# EasyEDA schematic RP2040.json
TITLE: RP2040 Minimal Design for JLCPCB; REV: 1.0; Date: 2023-03-28; Sheet: 1/1; Drawn By: Jeff Rebeiro; Company: ACustomArcade
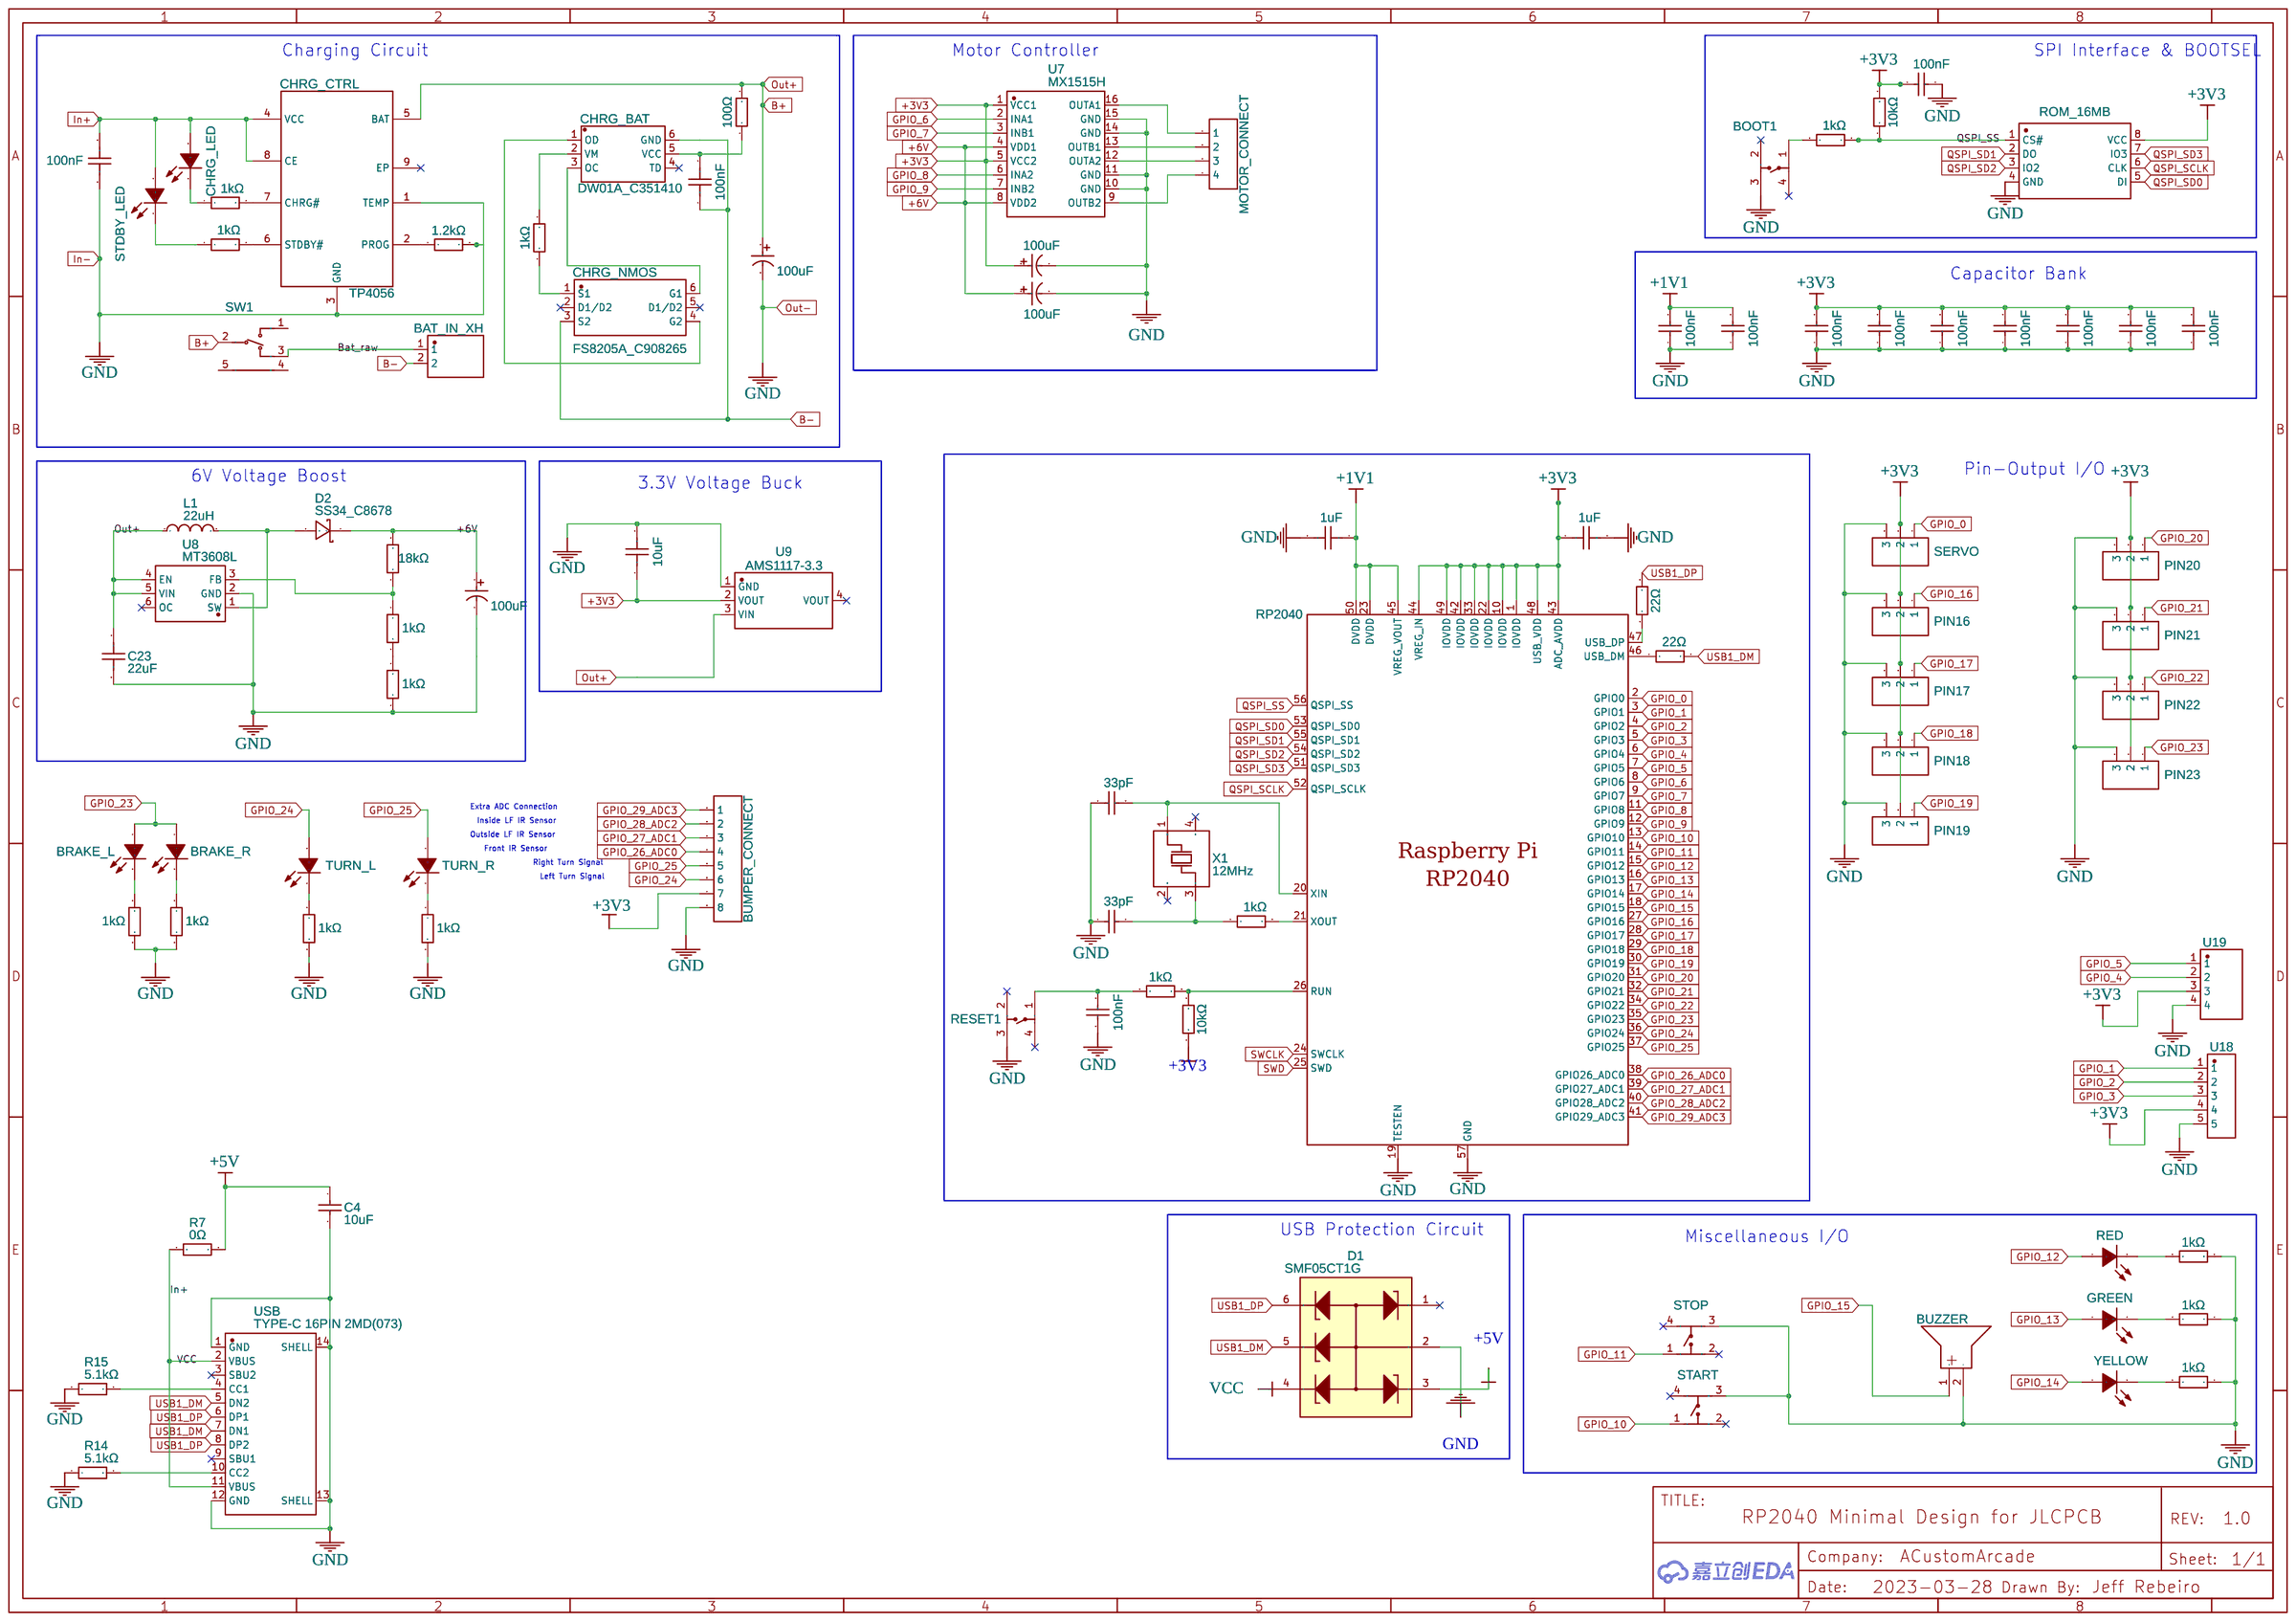
[diagram p0: schematic sheet]

## Parts
BAT_IN_XH  B2B-XH-A (LF)(SN)  [CONN-TH_B2B-XH-A-LF-SN]
BOOT1  TD-1182SA-2.0H-250  [SW-SMD_4P-L3.5-W3.0-P1.50-LS4.6_DEALON_TD-1182SA-2.0H-250]
BRAKE_L  E6C0805UR  [LED0805-R-RD]
BRAKE_R  E6C0805UR  [LED0805-R-RD]
BUMPER_CONNECT  HDR-F-2.54_1x8  [HDR-F-2.54_1X8]
BUZZER  3kHz  [BUZ-TH_BD9.0-P5.00-D0.6-FD]
C1  100uF  [CAP-SMD_BD6.3-L6.6-W6.6-LS7.2-R-RD]
C2  33pF  [C0402]
C3  33pF  [C0402]
C4  10uF  [C1206]
C5  100nF  [C0402_NEW]
C6  100nF  [C0402_NEW]
C7  100nF  [C0402_NEW]
C8  1uF  [C0402]
C9  100nF  [C0402_NEW]
C10  1uF  [C0402]
C11  100nF  [C0402_NEW]
C12  100nF  [C0402_NEW]
C13  100nF  [C0402_NEW]
C14  100nF  [C0402_NEW]
C15  100nF  [C0402_NEW]
C16  100nF  [C0402_NEW]
C17  100nF  [C0402_NEW]
C18  10uF  [C0603]
C19  100nF  [C0603]
C20  100nF  [C0603]
C21  100uF  [CAP-SMD_BD6.3-L6.6-W6.6-LS7.2-R-RD]
C23  22uF  [C0603]
C26  100uF  [CAP-SMD_BD6.3-L6.6-W6.6-LS7.2-R-RD]
C27  100uF  [CAP-SMD_BD6.3-L6.6-W6.6-LS7.2-R-RD]
CHRG_BAT  DW01A_C351410  [SOT-23-6_L2.9-W1.6-P0.95-LS2.8-BL]
CHRG_CTRL  TP4056  [ESOP-8_L4.9-W3.9-P1.27-LS6.0-BL-EP]
CHRG_LED  FC-2012HRK-620D  [LED0805-R-RD]
CHRG_NMOS  FS8205A_C908265  [SOT-23-6_L2.9-W1.6-P0.95-LS2.8-BR]
D1  SMF05CT1G  [SOT-363_L2.0-W1.3-P0.65-LS2.1-TL]
D2  SS34_C8678  [SMA_L4.3-W2.6-LS5.2-RD]
GREEN  0805G (Green)  [LED0805-R-RD]
L1  22uH  [IND-SMD_L7.0-W6.8]
MOTOR_CONNECT  HDR-F-2.54_1x4  [HDR-F-2.54_1X4]
PIN16  HDR-F-2.54_1x3  [HDR-F-2.54_1X3]
PIN17  HDR-F-2.54_1x3  [HDR-F-2.54_1X3]
PIN18  HDR-F-2.54_1x3  [HDR-F-2.54_1X3]
PIN19  HDR-F-2.54_1x3  [HDR-F-2.54_1X3]
PIN20  HDR-F-2.54_1x3  [HDR-F-2.54_1X3]
PIN21  HDR-F-2.54_1x3  [HDR-F-2.54_1X3]
PIN22  HDR-F-2.54_1x3  [HDR-F-2.54_1X3]
PIN23  HDR-F-2.54_1x3  [HDR-F-2.54_1X3]
R1  1kΩ  [R0402]
R2  10kΩ  [R0402]
R3  22Ω  [R0402]
R4  22Ω  [R0402]
R5  1kΩ  [R0402]
R6  1kΩ  [R0805]
R7  0Ω  [R0603]
R8  1kΩ  [R0402]
R9  1kΩ  [R0402]
R10  10kΩ  [R0402]
R11  1kΩ  [R0805]
R12  1kΩ  [R0805]
R13  1kΩ  [R0402]
R14  5.1kΩ  [R0402]
R15  5.1kΩ  [R0402]
R16  100Ω  [R0805]
R17  1.2kΩ  [R0805]
R18  1kΩ  [R0402]
R19  1kΩ  [R0402]
R20  1kΩ  [R0402]
R21  1kΩ  [R0402]
R24  1kΩ  [R0402]
R25  1kΩ  [R0402]
R26  1kΩ  [R0402]
R27  18kΩ  [R0402]
RED  FC-2012HRK-620D  [LED0805-R-RD]
RESET1  TD-1182SA-2.0H-250  [SW-SMD_4P-L3.5-W3.0-P1.50-LS4.6_DEALON_TD-1182SA-2.0H-250]
ROM_16MB  W25Q128JVSIQTR  [SOIC-8_L5.3-W5.3-P1.27-LS8.0-BL]
SERVO  HDR-F-2.54_1x3  [HDR-F-2.54_1X3]
START  TSA063G60-250  [KEY-SMD_4P-L6.1-W6.1-P4.50-LS9.0]
STDBY_LED  0805G (Green)  [LED0805-R-RD]
STOP  TSA063G60-250  [KEY-SMD_4P-L6.1-W6.1-P4.50-LS9.0]
SW1  ST-0-103-C03-N003-RS  [SW-TH_ST-0-103-C03-N003-RS]
TURN_L  17-21SUYC/TR8  [LED0805-R-RD]
TURN_R  17-21SUYC/TR8  [LED0805-R-RD]
U3  RP2040  [LQFN-56_L7.0-W7.0-P0.4-EP]
U7  MX1515H  [SOP-16_L9.9-W3.9-P1.27-LS6.0-BL]
U8  MT3608L  [SOT-23-6_L2.9-W1.7-P0.95-LS2.8-BL]
U9  AMS1117-3.3  [SOT-223-3_L6.5-W3.4-P2.30-LS7.0-BR]
U18  DW254W-11-05-85  [CONN-TH_5P-P2.54_DEALON_DW254W-11-05-85]
U19  KH-2FH-1X4P-H4.3  [HDR-TH_4P-P2.00-V-F]
USB  TYPE-C 16PIN 2MD(073)  [USB-C-SMD_TYPE-C-6PIN-2MD-073]
X1  12MHz  [OSC-SMD_4P-L3.2-W2.5-BL]
YELLOW  17-21SUYC/TR8  [LED0805-R-RD]

## Library data of the parts
BAT_IN_XH = B2B-XH-A (LF)(SN): Contributor: LCSC; Supplier: LCSC; Supplier Part: C158012; Manufacturer: JST; Manufacturer Part: B2B-XH-A(LF)(SN); JLCPCB Part Class: Extended Part; link: https://lcsc.com/eda_search?q=C158012&%26type=1&ref=editor
BOOT1 RESET1 = TD-1182SA-2.0H-250: Supplier: LCSC; Supplier Part: C2905178; Manufacturer: DEALON(德艺隆); Contributor: LCSC; JLCPCB Part Class: Extended Part
BRAKE_L BRAKE_R = E6C0805UR: Supplier: LCSC; Manufacturer: KENTO; Supplier Part: C2295; JLCPCB Part Class: Extended Part; link: https://lcsc.com/eda_search?q=C2295&%26type=1&ref=editor
BUMPER_CONNECT = HDR-F-2.54_1x8: Supplier Part: C225505; Supplier: LCSC; Contributor: LCEDA_Lib
BUZZER = HNB09A03: Contributor: LCSC; Supplier: LCSC; Supplier Part: C96102; Manufacturer: 华能; JLCPCB Part Class: Extended Part; link: https://lcsc.com/eda_search?q=C96102&%26type=1&ref=editor
C1 C21 C26 C27 = CS1C101M-CRE54: Supplier: LCSC; Manufacturer: ST(先科); Supplier Part: C97805; JLCPCB Part Class: Extended Part; link: https://lcsc.com/eda_search?q=C97805&%26type=1&ref=editor
C2 C3 = 0402CG330J500NT: Supplier: LCSC; Manufacturer: FH(风华); Supplier Part: C1562; JLCPCB Part Class: Basic Part
C4 = CL31A106KBHNNNE: Supplier: LCSC; Manufacturer: SAMSUNG(三星); Supplier Part: C13585; JLCPCB Part Class: Basic Part
C5-C7 C9 C11-C17 = CL05B104KO5NNNC: Supplier: LCSC; Manufacturer: SAMSUNG(三星); Supplier Part: C1525; JLCPCB Part Class: Basic Part
C8 C10 = CL05A105KA5NQNC: Supplier: LCSC; Manufacturer: SAMSUNG(三星); Supplier Part: C52923; JLCPCB Part Class: Basic Part
C18 = CL10A106KP8NNNC: Supplier: LCSC; Manufacturer: SAMSUNG(三星); Supplier Part: C19702; JLCPCB Part Class: Basic Part; link: https://lcsc.com/eda_search?q=C19702&%26type=1&ref=editor
C19 C20 = CC0603KRX7R9BB104: Supplier: LCSC; Manufacturer: YAGEO(国巨); Supplier Part: C14663; JLCPCB Part Class: Basic Part; link: https://lcsc.com/eda_search?q=C14663&%26type=1&ref=editor
C23 = CL10A226MQ8NRNC: Supplier: LCSC; Manufacturer: SAMSUNG(三星); Supplier Part: C59461; JLCPCB Part Class: Basic Part; link: https://lcsc.com/eda_search?q=C59461&%26type=1&ref=editor
CHRG_BAT = DW01A_C351410: Contributor: LCSC; Supplier: LCSC; Supplier Part: C351410; Manufacturer: PUOLOP(迪浦); Manufacturer Part: DW01A; JLCPCB Part Class: Extended Part; link: https://lcsc.com/eda_search?q=C351410&%26type=1&ref=editor
CHRG_CTRL = TP4056: Contributor: Guest; Supplier: LCSC; Manufacturer: TOPPOWER(南京拓微); Manufacturer Part: TP4056-42-ESOP8; Supplier Part: C16581; JLCPCB Part Class: Basic Part; link: https://lcsc.com/eda_search?q=C16581&%26type=1&ref=editor
CHRG_LED RED = FC-2012HRK-620D: Supplier: LCSC; Manufacturer: 国星光电; Manufacturer Part: NCD0805R1; Supplier Part: C84256; JLCPCB Part Class: Basic Part; link: https://lcsc.com/eda_search?q=C84256&%26type=1&ref=editor
CHRG_NMOS = FS8205A_C908265: Contributor: LCSC; JLCPCB Part Class: Extended Part; Supplier: LCSC; Supplier Part: C908265; Manufacturer: FUXINSEMI(富芯森美); Manufacturer Part: FS8205A; link: https://lcsc.com/eda_search?q=C908265&%26type=1&ref=editor
D1 = SMF05CT1G: Supplier: LCSC; Manufacturer: onsemi(安森美); Supplier Part: C15879; JLCPCB Part Class: Basic Part
D2 = SS34_C8678: Supplier: LCSC; Manufacturer Part: SS34; Manufacturer: MDD; Supplier Part: C8678; JLCPCB Part Class: Basic Part; link: https://lcsc.com/eda_search?q=C8678&%26type=1&ref=editor
GREEN STDBY_LED = 0805G (Green): Supplier: LCSC; Manufacturer: KENTO; Manufacturer Part: KT-0805翠绿; Supplier Part: C2297; JLCPCB Part Class: Basic Part; link: https://lcsc.com/eda_search?q=C2297&%26type=1&ref=editor
L1 = SMRH74-220MT: Supplier: LCSC; Manufacturer: SXN(顺翔诺); Supplier Part: C27442; JLCPCB Part Class: Extended Part; link: https://lcsc.com/eda_search?q=C27442&%26type=1&ref=editor
MOTOR_CONNECT = HDR-F-2.54_1x4: Supplier Part: C225501; Supplier: LCSC; Contributor: LCEDA_Lib
PIN16-PIN23 SERVO = HDR-F-2.54_1x3: Supplier Part: C146690; Supplier: LCSC; Contributor: LCEDA_Lib
R1 R5 R8 R9 R13 R18-R21 R24-R26 = 0402WGF1001TCE: Supplier: LCSC; Manufacturer: UNI-ROYAL(厚声); Supplier Part: C11702; Resistance (Ohms): 1K; JLCPCB Part Class: Basic Part
R2 R10 = 0402WGF1002TCE: Supplier: LCSC; Manufacturer: UNI-ROYAL(厚声); Supplier Part: C25744; Resistance (Ohms): 10K; JLCPCB Part Class: Basic Part
R3 R4 = 0402WGF220JTCE: Supplier: LCSC; Manufacturer: UNI-ROYAL(厚声); Supplier Part: C25092; Resistance (Ohms): 22; JLCPCB Part Class: Basic Part
R6 R11 R12 = 0805W8F1001T5E: Supplier: LCSC; Manufacturer: UNI-ROYAL(厚声); Supplier Part: C17513; JLCPCB Part Class: Basic Part; link: https://lcsc.com/eda_search?q=C17513&%26type=1&ref=editor
R7 = 0603WAF0000T5E: Supplier: LCSC; Manufacturer: UNI-ROYAL(厚声); Supplier Part: C21189; Resistance (Ohms): 0; JLCPCB Part Class: Basic Part
R14 R15 = 0402WGF5101TCE: Supplier: LCSC; Manufacturer: UNI-ROYAL(厚声); Supplier Part: C25905; Resistance (Ohms): 5.1K; JLCPCB Part Class: Basic Part
R16 = 0805W8F1000T5E: Supplier: LCSC; Manufacturer: UNI-ROYAL(厚声); Supplier Part: C17408; JLCPCB Part Class: Basic Part; link: https://lcsc.com/eda_search?q=C17408&%26type=1&ref=editor
R17 = 0805W8F1201T5E: Supplier: LCSC; Manufacturer: UNI-ROYAL(厚声); Supplier Part: C17379; JLCPCB Part Class: Basic Part; link: https://lcsc.com/eda_search?q=C17379&%26type=1&ref=editor
R27 = 0402WGF1802TCE: Supplier: LCSC; Manufacturer: UNI-ROYAL(厚声); Supplier Part: C25762; JLCPCB Part Class: Basic Part; link: https://lcsc.com/eda_search?q=C25762&%26type=1&ref=editor
ROM_16MB = W25Q128JVSIQTR: Supplier: LCSC; Manufacturer: WINBOND(华邦); Manufacturer Part: W25Q128JVSIQ; Supplier Part: C97521; JLCPCB Part Class: Basic Part
START STOP = TSA063G60-250: Contributor: LCSC; Supplier: LCSC; Supplier Part: C294566; Manufacturer: BRIGHT(博瑞泰); JLCPCB Part Class: Extended Part; link: https://lcsc.com/eda_search?q=C294566&%26type=1&ref=editor
SW1 = ST-0-103-C03-N003-RS: Contributor: LCSC; Supplier: LCSC; Supplier Part: C1788490; Manufacturer: YUEN FUNG(源丰); JLCPCB Part Class: Extended Part; link: https://lcsc.com/eda_search?q=C1788490&%26type=1&ref=editor
TURN_L TURN_R YELLOW = 17-21SUYC/TR8: Supplier: LCSC; Manufacturer: KENTO; Manufacturer Part: KT-0805黄灯; Supplier Part: C2296; JLCPCB Part Class: Basic Part; link: https://lcsc.com/eda_search?q=C2296&%26type=1&ref=editor
U3 = RP2040: Supplier: LCSC; Supplier Part: C2040; Manufacturer: Raspberry Pi(树莓派); JLCPCB Part Class: Extended Part; Contributor: LCSC
U7 = MX1515H: Contributor: lcsc; Supplier: LCSC; Supplier Part: C5119046; Manufacturer: Mixic(中科芯亿达); JLCPCB Part Class: Extended Part; link: https://lcsc.com/eda_search?q=C5119046&%26type=1&ref=editor
U8 = MT3608L: Contributor: LCSC; Supplier: LCSC; Supplier Part: C2932326; Manufacturer: 西安航天民芯; JLCPCB Part Class: Extended Part; link: https://lcsc.com/eda_search?q=C2932326&%26type=1&ref=editor; Package Display: No
U9 = AMS1117-3.3: sourceId: dwIGgezVh; Supplier: LCSC; Manufacturer: AMS; Supplier Part: C6186; JLCPCB Part Class: Basic Part
U18 = DW254W-11-05-85: Contributor: LCSC; Supplier: LCSC; Supplier Part: C2935995; Manufacturer: DEALON(德艺隆); JLCPCB Part Class: Extended Part; link: https://lcsc.com/eda_search?q=C2935995&%26type=1&ref=editor
U19 = KH-2FH-1X4P-H4.3: Contributor: LCSC; Supplier: LCSC; Supplier Part: C2938431; Manufacturer: kinghelm(金航标); JLCPCB Part Class: Extended Part; link: https://lcsc.com/eda_search?q=C2938431&%26type=1&ref=editor
USB = TYPE-C 16PIN 2MD(073): Supplier: LCSC; Supplier Part: C2765186; Manufacturer: SHOU HAN(首韩); Contributor: LCSC; JLCPCB Part Class: Extended Part
X1 = X322512MSB4SI: Supplier: LCSC; Manufacturer: YXC; Supplier Part: C9002; JLCPCB Part Class: Basic Part

## Nets
+1V1: C6.2 C7.2 C8.1 U3.23(DVDD) U3.45(VREG_VOUT) U3.50(DVDD)
+3V3: BUMPER_CONNECT.7 C5.2 C9.2 C10.1 C11.2 C12.2 C13.2 C14.2 C15.2 C16.2 C18.1 C27.1 PIN16.2 PIN17.2 PIN18.2 PIN19.2 PIN20.2 PIN21.2 PIN22.2 PIN23.2 R2.2 R10.1 ROM_16MB.8(VCC) SERVO.2 U3.1(IOVDD) U3.10(IOVDD) U3.22(IOVDD) U3.33(IOVDD) U3.42(IOVDD) U3.43(ADC_AVDD) U3.44(VREG_IN) U3.48(USB_VDD) U3.49(IOVDD) U7.1(VCC1) U7.5(VCC2) U9.2(VOUT) U18.4 U19.3
+5V: C4.1 D1.3 R7.2
+6V: C21.1 C26.1 D2.1(K) R27.2 U7.4(VDD1) U7.8(VDD2)
GND: BOOT1.3 BUMPER_CONNECT.8 BUZZER.2(-) C1.2 C2.1 C3.1 C4.2 C5.1 C6.1 C7.1 C8.2 C9.1 C10.2 C11.1 C12.1 C13.1 C14.1 C15.1 C16.1 C17.1 C18.2 C20.1 C21.2 C23.2 C26.2 C27.2 CHRG_CTRL.1(TEMP) CHRG_CTRL.3(GND) D1.2 PIN16.3 PIN17.3 PIN18.3 PIN19.3 PIN20.3 PIN21.3 PIN22.3 PIN23.3 R8.2 R13.1 R14.1 R15.1 R17.2 R18.2 R20.1 R21.1 R24.2 R25.2 R26.2 RESET1.3 ROM_16MB.4(GND) SERVO.3 START.3 STOP.3 U3.19(TESTEN) U3.57(GND) U7.10(GND) U7.11(GND) U7.14(GND) U7.15(GND) U8.2(GND) U9.1(GND) U18.5 U19.4 USB.1(GND) USB.12(GND) USB.13(SHELL) USB.14(SHELL)
B+: C1.1 C23.1 CHRG_CTRL.5(BAT) L1.1 R16.2 SW1.2 U8.4(EN) U8.5(VIN) U9.3(VIN)
B-: BAT_IN_XH.2 C19.1 CHRG_BAT.6(GND) CHRG_NMOS.3(S2)
Bat_raw: BAT_IN_XH.1 SW1.3
GPIO_0: SERVO.1 U3.2(GPIO0)
GPIO_1: U3.3(GPIO1) U18.1
GPIO_2: U3.4(GPIO2) U18.2
GPIO_3: U3.5(GPIO3) U18.3
GPIO_4: U3.6(GPIO4) U19.2
GPIO_5: U3.7(GPIO5) U19.1
GPIO_6: U3.8(GPIO6) U7.2(INA1)
GPIO_7: U3.9(GPIO7) U7.3(INB1)
GPIO_8: U3.11(GPIO8) U7.6(INA2)
GPIO_9: U3.12(GPIO9) U7.7(INB2)
GPIO_10: START.1 U3.13(GPIO10)
GPIO_11: STOP.1 U3.14(GPIO11)
GPIO_12: RED.1(+) U3.15(GPIO12)
GPIO_13: GREEN.1(A) U3.16(GPIO13)
GPIO_14: U3.17(GPIO14) YELLOW.1(+)
GPIO_15: BUZZER.1(+) U3.18(GPIO15)
GPIO_16: PIN16.1 U3.27(GPIO16)
GPIO_17: PIN17.1 U3.28(GPIO17)
GPIO_18: PIN18.1 U3.29(GPIO18)
GPIO_19: PIN19.1 U3.30(GPIO19)
GPIO_20: PIN20.1 U3.31(GPIO20)
GPIO_21: PIN21.1 U3.32(GPIO21)
GPIO_22: PIN22.1 U3.34(GPIO22)
GPIO_23: BRAKE_L.1(A) BRAKE_R.1(A) PIN23.1 U3.35(GPIO23)
GPIO_24: BUMPER_CONNECT.6 TURN_L.1(+) U3.36(GPIO24)
GPIO_25: BUMPER_CONNECT.5 TURN_R.1(+) U3.37(GPIO25)
GPIO_26_ADC0: BUMPER_CONNECT.4 U3.38(GPIO26_ADC0)
GPIO_27_ADC1: BUMPER_CONNECT.3 U3.39(GPIO27_ADC1)
GPIO_28_ADC2: BUMPER_CONNECT.2 U3.40(GPIO28_ADC2)
GPIO_29_ADC3: BUMPER_CONNECT.1 U3.41(GPIO29_ADC3)
In+: C20.2 CHRG_CTRL.4(VCC) CHRG_CTRL.8(CE) CHRG_LED.1(+) D1.4 R7.1 STDBY_LED.1(A) USB.2(VBUS) USB.11(VBUS)
QSPI_SCLK: ROM_16MB.6(CLK) U3.52(QSPI_SCLK)
QSPI_SD0: ROM_16MB.5(DI) U3.53(QSPI_SD0)
QSPI_SD1: ROM_16MB.2(DO) U3.55(QSPI_SD1)
QSPI_SD2: ROM_16MB.3(IO2) U3.54(QSPI_SD2)
QSPI_SD3: ROM_16MB.7(IO3) U3.51(QSPI_SD3)
QSPI_SS: R1.2 R2.1 ROM_16MB.1(CS#) U3.56(QSPI_SS)
SWCLK: U3.24(SWCLK)
SWD: U3.25(SWD)
USB1_DM: D1.5 R4.2 USB.5(DN2) USB.7(DN1)
USB1_DP: D1.6 R3.2 USB.6(DP1) USB.8(DP2)
Net-(BOOT1-1): BOOT1.1 R1.1
Net-(BRAKE_L-2): BRAKE_L.2(K) R8.1
Net-(BRAKE_R-2): BRAKE_R.2(K) R24.1
Net-(C2-2): C2.2 U3.20(XIN) X1.1(OSC1)
Net-(C3-2): C3.2 R5.1 X1.3(OSC2)
Net-(C17-2): C17.2 R9.1 RESET1.1
Net-(C19-2): C19.2 CHRG_BAT.5(VCC) R16.1
Net-(CHRG_BAT-1): CHRG_BAT.1(OD) CHRG_NMOS.4(G2)
Net-(CHRG_BAT-2): CHRG_BAT.2(VM) R12.1
Net-(CHRG_BAT-3): CHRG_BAT.3(OC) CHRG_NMOS.6(G1)
Net-(CHRG_CTRL-2): CHRG_CTRL.2(PROG) R17.1
Net-(CHRG_CTRL-6): CHRG_CTRL.6(STDBY#) R11.2
Net-(CHRG_CTRL-7): CHRG_CTRL.7(CHRG#) R6.2
Net-(CHRG_LED-2): CHRG_LED.2(-) R6.1
Net-(CHRG_NMOS-1): CHRG_NMOS.1(S1) R12.2
Net-(D2-2): D2.2(A) L1.2 U8.1(SW)
Net-(GREEN-2): GREEN.2(K) R21.2
Net-(MOTOR_CONNECT-1): MOTOR_CONNECT.1 U7.16(OUTA1)
Net-(MOTOR_CONNECT-2): MOTOR_CONNECT.2 U7.13(OUTB1)
Net-(MOTOR_CONNECT-3): MOTOR_CONNECT.3 U7.12(OUTA2)
Net-(MOTOR_CONNECT-4): MOTOR_CONNECT.4 U7.9(OUTB2)
Net-(R3-1): R3.1 U3.47(USB_DP)
Net-(R4-1): R4.1 U3.46(USB_DM)
Net-(R5-2): R5.2 U3.21(XOUT)
Net-(R9-2): R9.2 R10.2 U3.26(RUN)
Net-(R11-1): R11.1 STDBY_LED.2(K)
Net-(R13-2): R13.2 YELLOW.2(-)
Net-(R14-2): R14.2 USB.10(CC2)
Net-(R15-2): R15.2 USB.4(CC1)
Net-(R18-1): R18.1 R19.2
Net-(R19-1): R19.1 R27.1 U8.3(FB)
Net-(R20-2): R20.2 RED.2(-)
Net-(R25-1): R25.1 TURN_L.2(-)
Net-(R26-1): R26.1 TURN_R.2(-)

Not connected (* = marked no-connect by the designer): BOOT1 2* 4*; CHRG_BAT 4(TD)*; CHRG_CTRL 9(EP)*; CHRG_NMOS 2(D1/D2)* 5(D1/D2)*; D1 1*; RESET1 2* 4*; START 2* 4*; STOP 2* 4*; SW1 1 4 5; U8 6(OC)*; U9 4(VOUT)*; USB 3(SBU2)* 9(SBU1)*; X1 2(GND)* 4(GND)*

## Notes on the sheet
- Charging Circuit
- Motor Controller
- SPI Interface & BOOTSEL
- Capacitor Bank
- 6V Voltage Boost
- 3.3V Voltage Buck
- Pin-Output I/O
- Extra ADC Connection
- Inside LF IR Sensor
- Outside LF IR Sensor
- Front IR Sensor
- Right Turn Signal
- Left Turn Signal
- USB Protection Circuit
- Miscellaneous I/O
